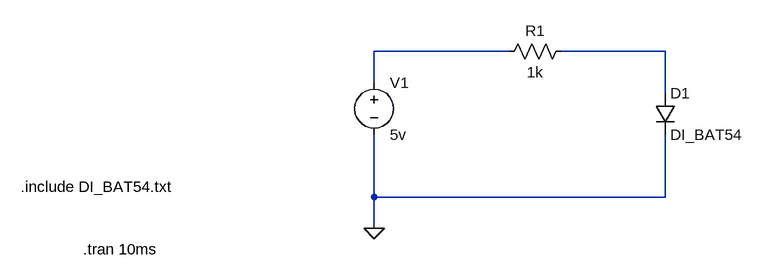
[diagram p0: schematic bat54-diode-test.asc]
bat54-diode-test.asc, the LTspice schematic file:
Version 4
SHEET 1 880 680
WIRE -576 -160 -784 -160
WIRE -336 -160 -496 -160
WIRE -784 -112 -784 -160
WIRE -336 -96 -336 -160
WIRE -784 64 -784 -32
WIRE -336 64 -336 -32
WIRE -336 64 -784 64
WIRE -784 112 -784 64
FLAG -784 112 0
SYMBOL voltage -784 -128 R0
WINDOW 123 0 0 Left 2
WINDOW 39 0 0 Left 2
SYMATTR InstName V1
SYMATTR Value 5v
SYMBOL res -480 -176 R90
WINDOW 0 0 56 VBottom 2
WINDOW 3 32 56 VTop 2
SYMATTR InstName R1
SYMATTR Value 1k
SYMBOL diode -352 -96 R0
SYMATTR InstName D1
SYMATTR Value DI_BAT54
TEXT -1232 144 Left 2 !.tran 10ms
TEXT -1328 48 Left 2 !.include DI_BAT54.txt

The netlist it stands for:
* bat54-diode-test.asc
V1 N001 0 5v
R1 N002 N001 1k
D1 N002 0 DI_BAT54
.model D D
.lib standard.dio
.tran 10ms
.include DI_BAT54.txt
.backanno
.end